# Altium project iMX8M_CPU.PrjPcb (part 2 of 2)

## Sheet P[12]SOM_Interface.SchDoc
size A3
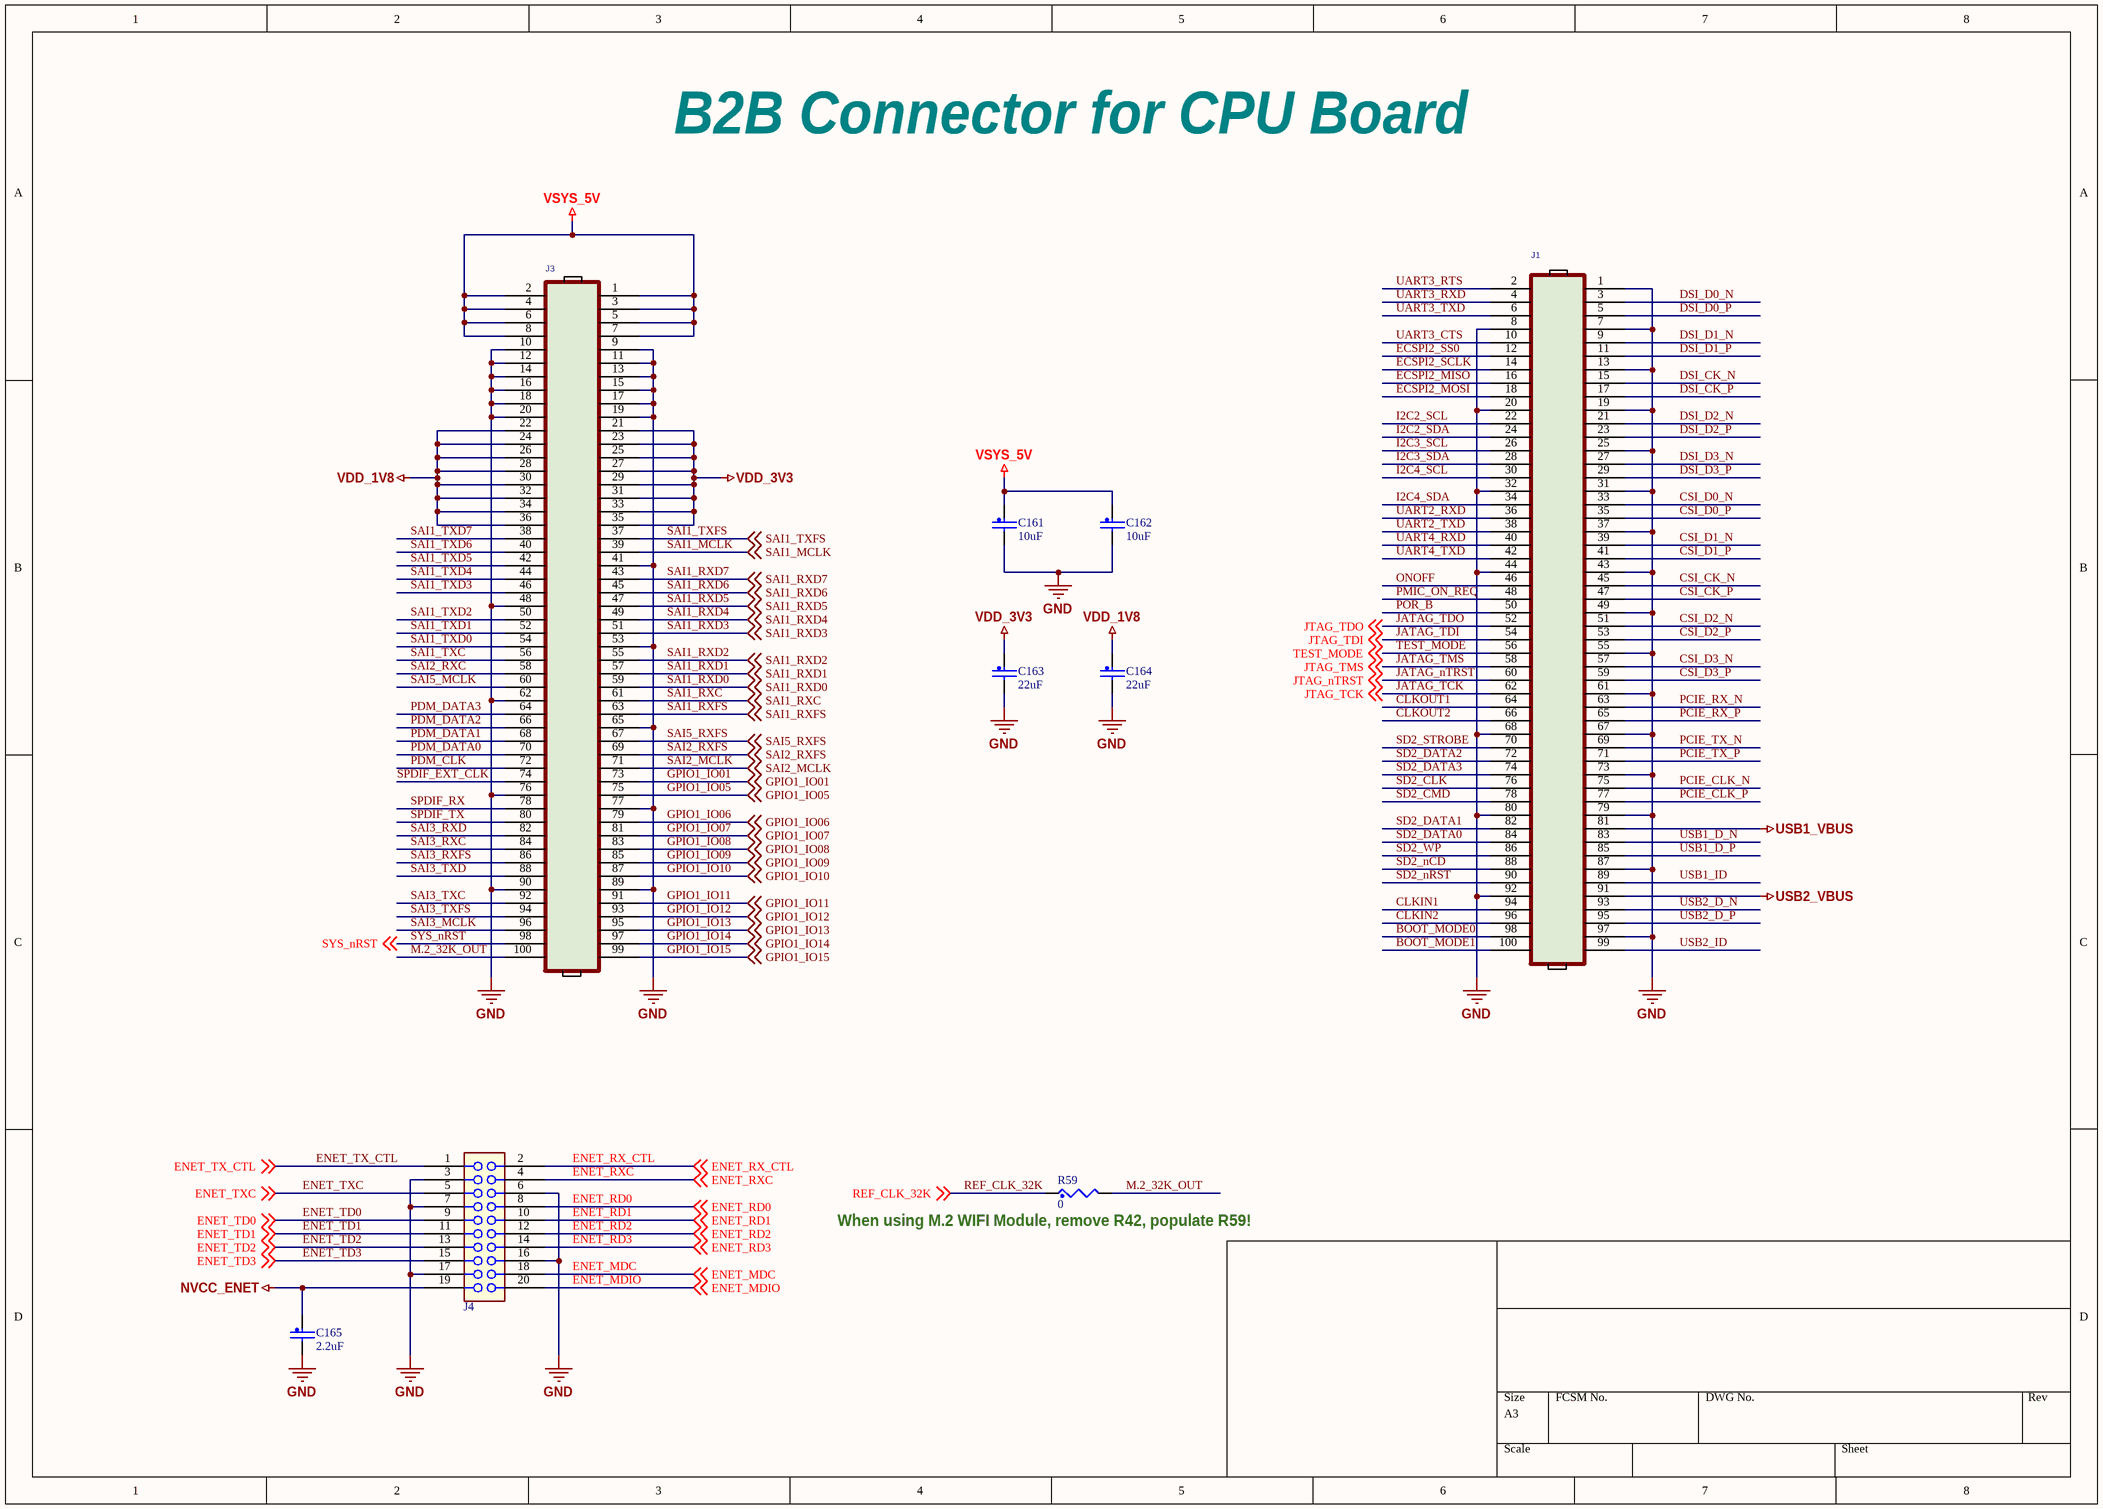
[diagram p9: P[12]SOM_Interface.SchDoc]

### Parts
C161  10uF  [0603_CC]
C162  10uF  [0603_CC]
C163  22uF  [0603_CC]
C164  22uF  [0603_CC]
C165  2.2uF  [0402_CC - C]
J1  CON 2X50 PLUG SHRD SMT 0.4MM SP 51H AU  [CON100_0P4_21P7X2P05_SM]  (value not drawn)
J3  CON 2X50 PLUG SHRD SMT 0.4MM SP 51H AU  [CON100_0P4_22P8X3P1_SM]  (value not drawn)
J4  CONN_HDR_10X2_CON20_0P4_6P8X3P1  [CON20_0P4_6P8X3P1_SM]  (value not drawn)
R59  0  [0402_CC]

### Nets
GND: C161.2 C162.2 C163.2 C164.2 C165.2 J1.1 J1.7 J1.8 J1.13 J1.19 J1.20 J1.25 J1.31 J1.32 J1.37 J1.43 J1.44 J1.49 J1.55 J1.61 J1.67 J1.68 J1.73 J1.79 J1.80 J1.87 J1.92 J1.97 J3.9 J3.10 J3.11 J3.12 J3.13 J3.14 J3.15 J3.16 J3.17 J3.18 J3.19 J3.20 J3.41 J3.48 J3.53 J3.62 J3.65 J3.76 J3.77 J3.89 J3.90 J4.3 J4.6 J4.7 J4.16 J4.17
NVCC_ENET: C165.1 J4.19
USB1_VBUS: J1.81
USB2_VBUS: J1.91
VDD_1V8: C164.1 J3.22 J3.24 J3.26 J3.28 J3.30 J3.32 J3.34 J3.36
VDD_3V3: C163.1 J3.21 J3.23 J3.25 J3.27 J3.29 J3.31 J3.33 J3.35
VSYS_5V: C161.1 C162.1 J3.1 J3.2 J3.3 J3.4 J3.5 J3.6 J3.7 J3.8
BOOT_MODE0: J1.98
BOOT_MODE1: J1.100
CLKIN1: J1.94
CLKIN2: J1.96
CLKOUT1: J1.64
CLKOUT2: J1.66
CSI_CK_N: J1.45
CSI_CK_P: J1.47
CSI_D0_N: J1.33
CSI_D0_P: J1.35
CSI_D1_N: J1.39
CSI_D1_P: J1.41
CSI_D2_N: J1.51
CSI_D2_P: J1.53
CSI_D3_N: J1.57
CSI_D3_P: J1.59
DSI_CK_N: J1.15
DSI_CK_P: J1.17
DSI_D0_N: J1.3
DSI_D0_P: J1.5
DSI_D1_N: J1.9
DSI_D1_P: J1.11
DSI_D2_N: J1.21
DSI_D2_P: J1.23
DSI_D3_N: J1.27
DSI_D3_P: J1.29
ECSPI2_MISO: J1.16
ECSPI2_MOSI: J1.18
ECSPI2_SCLK: J1.14
ECSPI2_SS0: J1.12
ENET_MDC: J4.18 ; off-sheet ENET_MDC
ENET_MDIO: J4.20 ; off-sheet ENET_MDIO
ENET_RD0: J4.8 ; off-sheet ENET_RD0
ENET_RD1: J4.10 ; off-sheet ENET_RD1
ENET_RD2: J4.12 ; off-sheet ENET_RD2
ENET_RD3: J4.14 ; off-sheet ENET_RD3
ENET_RX_CTL: J4.2 ; off-sheet ENET_RX_CTL
ENET_RXC: J4.4 ; off-sheet ENET_RXC
ENET_TD0: J4.9 ; off-sheet ENET_TD0
ENET_TD1: J4.11 ; off-sheet ENET_TD1
ENET_TD2: J4.13 ; off-sheet ENET_TD2
ENET_TD3: J4.15 ; off-sheet ENET_TD3
ENET_TX_CTL: J4.1 ; off-sheet ENET_TX_CTL
ENET_TXC: J4.5 ; off-sheet ENET_TXC
GPIO1_IO01: J3.73 ; off-sheet GPIO1_IO01
GPIO1_IO05: J3.75 ; off-sheet GPIO1_IO05
GPIO1_IO06: J3.79 ; off-sheet GPIO1_IO06
GPIO1_IO07: J3.81 ; off-sheet GPIO1_IO07
GPIO1_IO08: J3.83 ; off-sheet GPIO1_IO08
GPIO1_IO09: J3.85 ; off-sheet GPIO1_IO09
GPIO1_IO10: J3.87 ; off-sheet GPIO1_IO10
GPIO1_IO11: J3.91 ; off-sheet GPIO1_IO11
GPIO1_IO12: J3.93 ; off-sheet GPIO1_IO12
GPIO1_IO13: J3.95 ; off-sheet GPIO1_IO13
GPIO1_IO14: J3.97 ; off-sheet GPIO1_IO14
GPIO1_IO15: J3.99 ; off-sheet GPIO1_IO15
I2C2_SCL: J1.22
I2C2_SDA: J1.24
I2C3_SCL: J1.26
I2C3_SDA: J1.28
I2C4_SCL: J1.30
I2C4_SDA: J1.34
JATAG_nTRST: J1.60 ; off-sheet JTAG_nTRST  [also labelled JTAG_nTRST]
JATAG_TCK: J1.62 ; off-sheet JTAG_TCK  [also labelled JTAG_TCK]
JATAG_TDI: J1.54 ; off-sheet JTAG_TDI  [also labelled JTAG_TDI]
JATAG_TDO: J1.52 ; off-sheet JTAG_TDO  [also labelled JTAG_TDO]
JATAG_TMS: J1.58 ; off-sheet JTAG_TMS  [also labelled JTAG_TMS]
M.2_32K_OUT: J3.100 R59.2
ONOFF: J1.46
PCIE_CLK_N: J1.75
PCIE_CLK_P: J1.77
PCIE_RX_N: J1.63
PCIE_RX_P: J1.65
PCIE_TX_N: J1.69
PCIE_TX_P: J1.71
PDM_CLK: J3.72
PDM_DATA0: J3.70
PDM_DATA1: J3.68
PDM_DATA2: J3.66
PDM_DATA3: J3.64
PMIC_ON_REQ: J1.48
POR_B: J1.50
REF_CLK_32K: R59.1 ; off-sheet REF_CLK_32K
SAI1_MCLK: J3.39 ; off-sheet SAI1_MCLK
SAI1_RXC: J3.61 ; off-sheet SAI1_RXC
SAI1_RXD0: J3.59 ; off-sheet SAI1_RXD0
SAI1_RXD1: J3.57 ; off-sheet SAI1_RXD1
SAI1_RXD2: J3.55 ; off-sheet SAI1_RXD2
SAI1_RXD3: J3.51 ; off-sheet SAI1_RXD3
SAI1_RXD4: J3.49 ; off-sheet SAI1_RXD4
SAI1_RXD5: J3.47 ; off-sheet SAI1_RXD5
SAI1_RXD6: J3.45 ; off-sheet SAI1_RXD6
SAI1_RXD7: J3.43 ; off-sheet SAI1_RXD7
SAI1_RXFS: J3.63 ; off-sheet SAI1_RXFS
SAI1_TXC: J3.56
SAI1_TXD0: J3.54
SAI1_TXD1: J3.52
SAI1_TXD2: J3.50
SAI1_TXD3: J3.46
SAI1_TXD4: J3.44
SAI1_TXD5: J3.42
SAI1_TXD6: J3.40
SAI1_TXD7: J3.38
SAI1_TXFS: J3.37 ; off-sheet SAI1_TXFS
SAI2_MCLK: J3.71 ; off-sheet SAI2_MCLK
SAI2_RXC: J3.58
SAI2_RXFS: J3.69 ; off-sheet SAI2_RXFS
SAI3_MCLK: J3.96
SAI3_RXC: J3.84
SAI3_RXD: J3.82
SAI3_RXFS: J3.86
SAI3_TXC: J3.92
SAI3_TXD: J3.88
SAI3_TXFS: J3.94
SAI5_MCLK: J3.60
SAI5_RXFS: J3.67 ; off-sheet SAI5_RXFS
SD2_CLK: J1.76
SD2_CMD: J1.78
SD2_DATA0: J1.84
SD2_DATA1: J1.82
SD2_DATA2: J1.72
SD2_DATA3: J1.74
SD2_nCD: J1.88
SD2_nRST: J1.90
SD2_STROBE: J1.70
SD2_WP: J1.86
SPDIF_EXT_CLK: J3.74
SPDIF_RX: J3.78
SPDIF_TX: J3.80
SYS_nRST: J3.98 ; off-sheet SYS_nRST
TEST_MODE: J1.56 ; off-sheet TEST_MODE
UART2_RXD: J1.36
UART2_TXD: J1.38
UART3_CTS: J1.10
UART3_RTS: J1.2
UART3_RXD: J1.4
UART3_TXD: J1.6
UART4_RXD: J1.40
UART4_TXD: J1.42
USB1_D_N: J1.83
USB1_D_P: J1.85
USB1_ID: J1.89
USB2_D_N: J1.93
USB2_D_P: J1.95
USB2_ID: J1.99

### Notes on the sheet
- B2B Connector for CPU Board
- (near R59) When using M.2 WIFI Module, remove R42, populate R59!

### Library data of the parts
C161-C165 = CAP_NP: CLASS: DISCRETE
J1 J3 = HDR_2X50_M: CLASS: IO; CAD_APPROVED: Yes; Temp_Range: -35 to 85 &#8451;; MFG_PN01: DF40C-100DP-0.4V(51); MFG_NAME01: Hirose; AGILE_PN: 211-80305; HEIGHT: 1.29MM; ROHS: Yes
J4 = CONN_HDR_10X2: CONN_HDR_10X2_CON20_0P4_6P8X3P1\By Arman Arvand; CLASS: IO
R59 = RES: CLASS: DISCRETE

## Sheet P[13]BOOT_CFG.SchDoc
size 513 x 386 mm
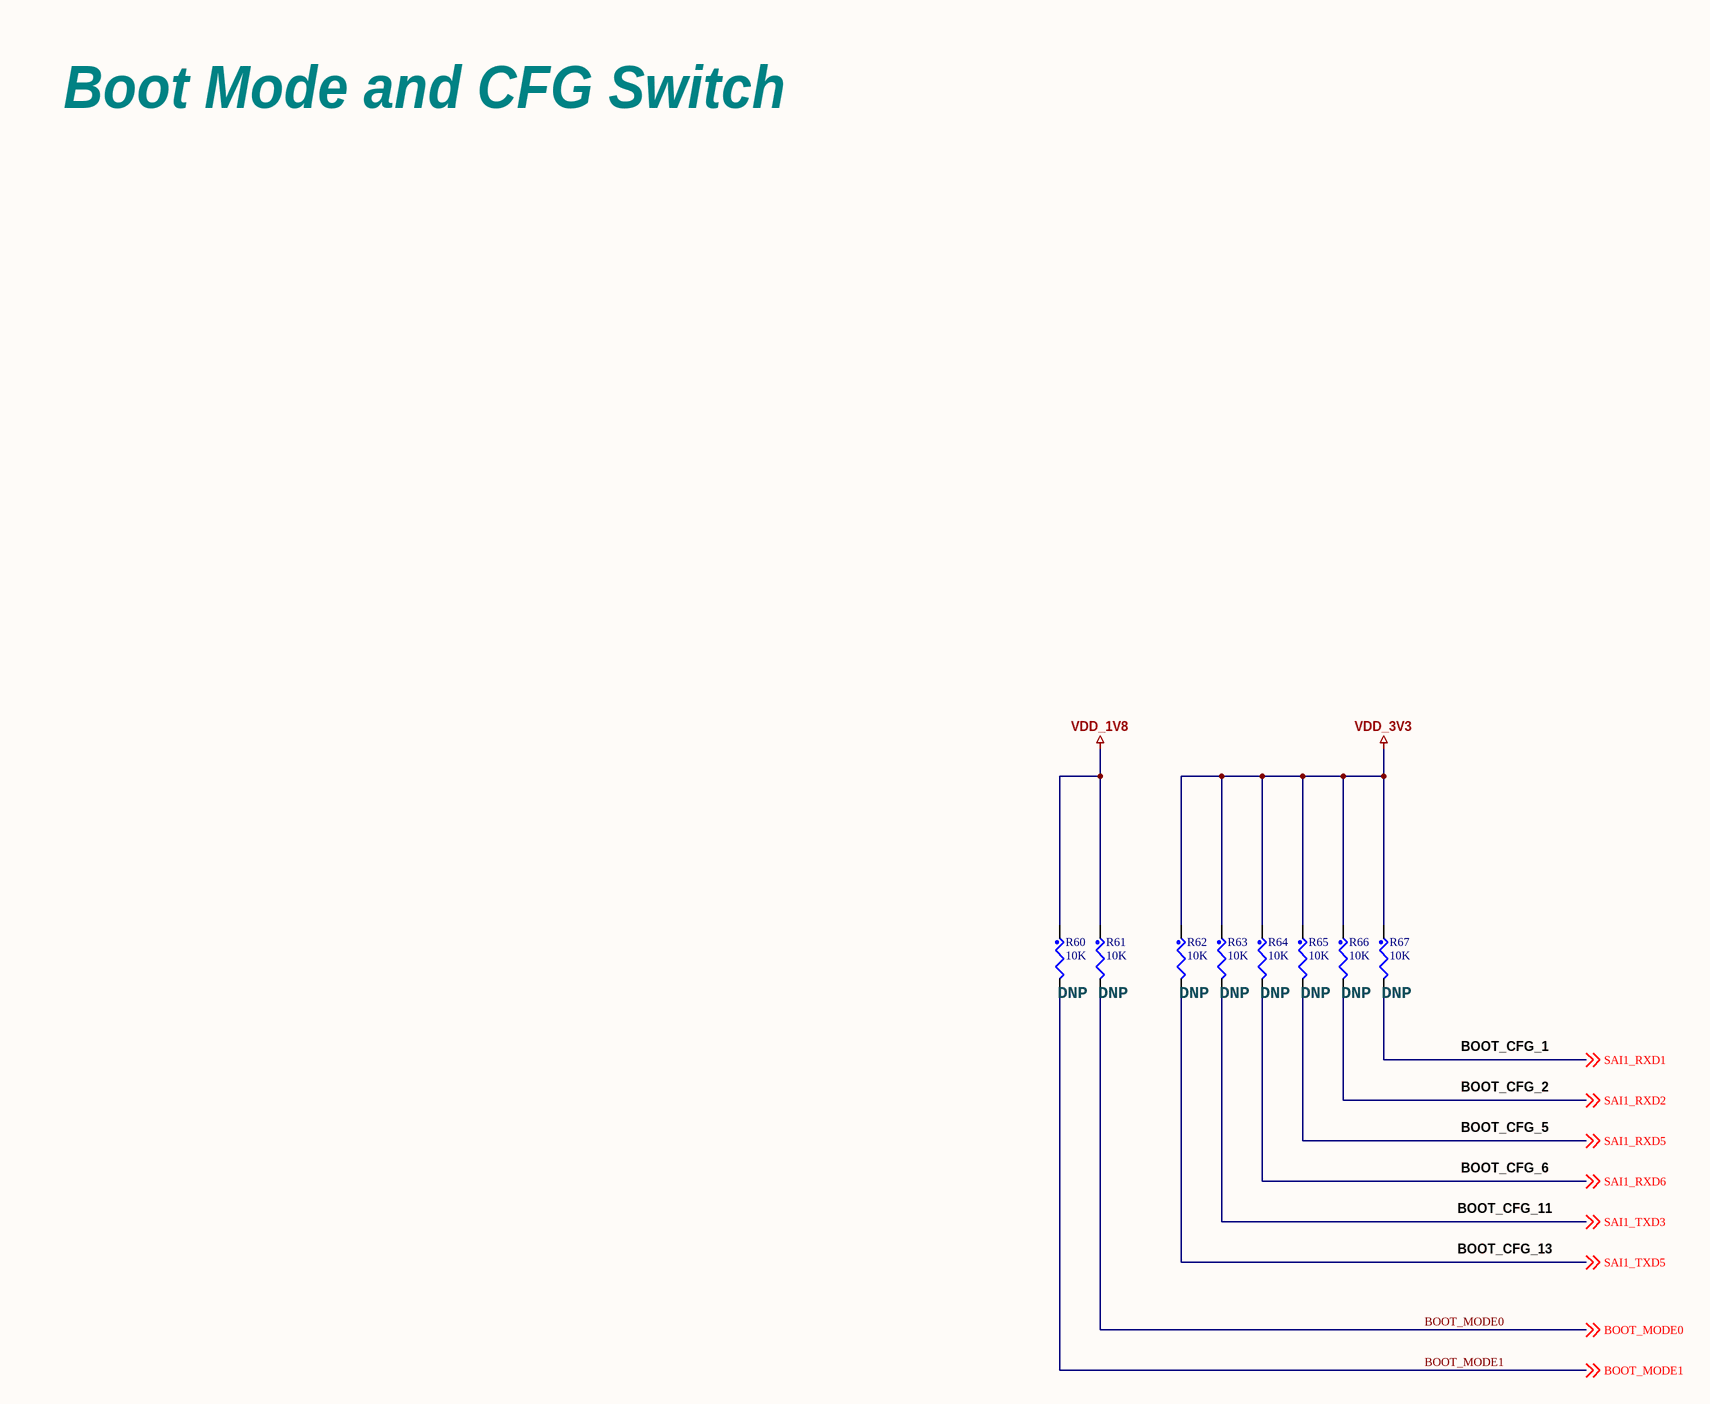
[diagram p10: P[13]BOOT_CFG.SchDoc]

### Parts
R60  10K  [0402_CC]
R61  10K  [0402_CC]
R62  10K  [0402_CC]
R63  10K  [0402_CC]
R64  10K  [0402_CC]
R65  10K  [0402_CC]
R66  10K  [0402_CC]
R67  10K  [0402_CC]

### Nets
VDD_1V8: R60.1 R61.1
VDD_3V3: R62.1 R63.1 R64.1 R65.1 R66.1 R67.1
BOOT_MODE0: R61.2 ; off-sheet BOOT_MODE0
BOOT_MODE1: R60.2 ; off-sheet BOOT_MODE1
SAI1_RXD1: R67.2 ; off-sheet SAI1_RXD1
SAI1_RXD2: R66.2 ; off-sheet SAI1_RXD2
SAI1_RXD5: R65.2 ; off-sheet SAI1_RXD5
SAI1_RXD6: R64.2 ; off-sheet SAI1_RXD6
SAI1_TXD3: R63.2 ; off-sheet SAI1_TXD3
SAI1_TXD5: R62.2 ; off-sheet SAI1_TXD5

### Notes on the sheet
- Boot Mode and CFG Switch
- (near R60) DNP
- (near R61) DNP
- (near R62) DNP
- (near R63) DNP
- (near R64) DNP
- (near R65) DNP
- (near R66) DNP
- (near R67) DNP
- BOOT_CFG_1
- BOOT_CFG_2
- BOOT_CFG_5
- BOOT_CFG_6
- BOOT_CFG_11
- BOOT_CFG_13

### Library data of the parts
R60-R67 = RES: CLASS: DISCRETE

## Nets that join several sheets
GND: P[04]_CPU_POWER (159 pins), P[05]_PMIC (42 pins), P[06]_LPDDR4 (107 pins), P[07]_CPU_PHY (5 pins), P[08]_CPU_MISC (8 pins), P[09]_eMMC_QSPI (24 pins), P[10]WIFI_Bluetooth (37 pins), P[11]_CPU_IO (C143.2 Q1.2), P[12]SOM_Interface (54 pins)
NVCC_DRAM_1V1: P[04]_CPU_POWER (21 pins), P[05]_PMIC (C87.2 C88.2 L6.2 U3.38), P[06]_LPDDR4 (83 pins)
NVCC_ENET: P[04]_CPU_POWER (C20.1 U1.W22), P[12]SOM_Interface (C165.1 J4.19)
NVCC_SD2: P[04]_CPU_POWER (C19.1 U1.V22), P[05]_PMIC (C82.2 U3.55), P[11]_CPU_IO (R56.1 R57.1 R58.1)
NVCC_SNVS_1V8: P[04]_CPU_POWER (C5.1 U1.J22), P[05]_PMIC (5 pins), P[08]_CPU_MISC (R28.1 R29.1 R30.1)
USB1_VBUS: P[07]_CPU_PHY (C119.1 R23.2), P[12]SOM_Interface (J1.81)
USB2_VBUS: P[07]_CPU_PHY (C120.1 R26.2), P[12]SOM_Interface (J1.91)
VDD_1V8: P[04]_CPU_POWER (17 pins), P[05]_PMIC (9 pins), P[06]_LPDDR4 (16 pins), P[09]_eMMC_QSPI (15 pins), P[10]WIFI_Bluetooth (10 pins), P[11]_CPU_IO (8 pins), P[12]SOM_Interface (9 pins), P[13]BOOT_CFG (R60.1 R61.1)
VDD_3V3: P[04]_CPU_POWER (10 pins), P[05]_PMIC (7 pins), P[09]_eMMC_QSPI (7 pins), P[10]WIFI_Bluetooth (C136.1 C137.1 U6.41), P[11]_CPU_IO (R47.1), P[12]SOM_Interface (9 pins), P[13]BOOT_CFG (6 pins)
VDD_ARM_0V9: P[04]_CPU_POWER (20 pins), P[05]_PMIC (C62.2 C63.2 L2.2 U3.24)
VDD_DRAM_PU_0V9: P[04]_CPU_POWER (27 pins), P[05]_PMIC (C73.2 C74.2 L3.2 U3.30)
VDD_PHY_0V9: P[04]_CPU_POWER (C53.1 U1.J14), P[05]_PMIC (C69.1 U3.42)
VDD_PHY_1V2: P[04]_CPU_POWER (R1.2), P[05]_PMIC (C72.1 U3.44)
VDD_SNVS_0V8: P[04]_CPU_POWER (C6.1 U1.K22), P[05]_PMIC (C65.1 U3.8), P[08]_CPU_MISC (R34.1)
VDD_SOC_0V8: P[04]_CPU_POWER (25 pins), P[05]_PMIC (C59.2 C60.2 L1.2 U3.17)
VDDA_1V8: P[04]_CPU_POWER (17 pins), P[05]_PMIC (C76.1 U3.6)
VSYS_5V: P[05]_PMIC (22 pins), P[12]SOM_Interface (10 pins)
BOOT_MODE0: P[08]_CPU_MISC (U1.G26), P[12]SOM_Interface (J1.98), P[13]BOOT_CFG (R61.2)
BOOT_MODE1: P[08]_CPU_MISC (U1.G27), P[12]SOM_Interface (J1.100), P[13]BOOT_CFG (R60.2)
BT_CTS: P[10]WIFI_Bluetooth (U6.30), P[11]_CPU_IO (U1.E18)
BT_REG_ON: P[10]WIFI_Bluetooth (U6.40), P[11]_CPU_IO (U1.U27)
BT_RTS: P[10]WIFI_Bluetooth (U6.29), P[11]_CPU_IO (U1.D18)
BT_RXD: P[10]WIFI_Bluetooth (U6.27), P[11]_CPU_IO (U1.F13)
BT_TXD: P[10]WIFI_Bluetooth (U6.28), P[11]_CPU_IO (U1.E14)
BT_WAKE_DEV: P[10]WIFI_Bluetooth (U6.26), P[11]_CPU_IO (U1.U26)
BT_WAKE_HOST: P[10]WIFI_Bluetooth (U6.17), P[11]_CPU_IO (U1.W27)
CLK_32K_OUT: P[05]_PMIC (U3.29), P[08]_CPU_MISC (R33.1)
CLKIN1: P[08]_CPU_MISC (U1.H27), P[12]SOM_Interface (J1.94)
CLKIN2: P[08]_CPU_MISC (U1.J27), P[12]SOM_Interface (J1.96)
CLKOUT1: P[08]_CPU_MISC (U1.H26), P[12]SOM_Interface (J1.64)
CLKOUT2: P[08]_CPU_MISC (U1.J26), P[12]SOM_Interface (J1.66)
CSI_CK_N: P[07]_CPU_PHY (U1.A16), P[12]SOM_Interface (J1.45)
CSI_CK_P: P[07]_CPU_PHY (U1.B16), P[12]SOM_Interface (J1.47)
CSI_D0_N: P[07]_CPU_PHY (U1.A14), P[12]SOM_Interface (J1.33)
CSI_D0_P: P[07]_CPU_PHY (U1.B14), P[12]SOM_Interface (J1.35)
CSI_D1_N: P[07]_CPU_PHY (U1.A15), P[12]SOM_Interface (J1.39)
CSI_D1_P: P[07]_CPU_PHY (U1.B15), P[12]SOM_Interface (J1.41)
CSI_D2_N: P[07]_CPU_PHY (U1.A17), P[12]SOM_Interface (J1.51)
CSI_D2_P: P[07]_CPU_PHY (U1.B17), P[12]SOM_Interface (J1.53)
CSI_D3_N: P[07]_CPU_PHY (U1.A18), P[12]SOM_Interface (J1.57)
CSI_D3_P: P[07]_CPU_PHY (U1.B18), P[12]SOM_Interface (J1.59)
DSI_CK_N: P[07]_CPU_PHY (U1.A11), P[12]SOM_Interface (J1.15)
DSI_CK_P: P[07]_CPU_PHY (U1.B11), P[12]SOM_Interface (J1.17)
DSI_D0_N: P[07]_CPU_PHY (U1.A9), P[12]SOM_Interface (J1.3)
DSI_D0_P: P[07]_CPU_PHY (U1.B9), P[12]SOM_Interface (J1.5)
DSI_D1_N: P[07]_CPU_PHY (U1.A10), P[12]SOM_Interface (J1.9)
DSI_D1_P: P[07]_CPU_PHY (U1.B10), P[12]SOM_Interface (J1.11)
DSI_D2_N: P[07]_CPU_PHY (U1.A12), P[12]SOM_Interface (J1.21)
DSI_D2_P: P[07]_CPU_PHY (U1.B12), P[12]SOM_Interface (J1.23)
DSI_D3_N: P[07]_CPU_PHY (U1.A13), P[12]SOM_Interface (J1.27)
DSI_D3_P: P[07]_CPU_PHY (U1.B13), P[12]SOM_Interface (J1.29)
ECSPI2_MISO: P[11]_CPU_IO (U1.A8), P[12]SOM_Interface (J1.16)
ECSPI2_MOSI: P[11]_CPU_IO (U1.B8), P[12]SOM_Interface (J1.18)
ECSPI2_SCLK: P[11]_CPU_IO (U1.E6), P[12]SOM_Interface (J1.14)
ECSPI2_SS0: P[11]_CPU_IO (U1.A6), P[12]SOM_Interface (J1.12)
ENET_MDC: P[11]_CPU_IO (U1.AC27), P[12]SOM_Interface (J4.18)
ENET_MDIO: P[11]_CPU_IO (U1.AB27), P[12]SOM_Interface (J4.20)
ENET_RD0: P[11]_CPU_IO (U1.AE27), P[12]SOM_Interface (J4.8)
ENET_RD1: P[11]_CPU_IO (U1.AD27), P[12]SOM_Interface (J4.10)
ENET_RD2: P[11]_CPU_IO (U1.AD26), P[12]SOM_Interface (J4.12)
ENET_RD3: P[11]_CPU_IO (U1.AC26), P[12]SOM_Interface (J4.14)
ENET_RX_CTL: P[11]_CPU_IO (U1.AF27), P[12]SOM_Interface (J4.2)
ENET_RXC: P[11]_CPU_IO (U1.AE26), P[12]SOM_Interface (J4.4)
ENET_TD0: P[11]_CPU_IO (U1.AG26), P[12]SOM_Interface (J4.9)
ENET_TD1: P[11]_CPU_IO (U1.AF26), P[12]SOM_Interface (J4.11)
ENET_TD2: P[11]_CPU_IO (U1.AG25), P[12]SOM_Interface (J4.13)
ENET_TD3: P[11]_CPU_IO (U1.AF25), P[12]SOM_Interface (J4.15)
ENET_TX_CTL: P[11]_CPU_IO (U1.AF24), P[12]SOM_Interface (J4.1)
ENET_TXC: P[11]_CPU_IO (U1.AG24), P[12]SOM_Interface (J4.5)
GPIO1_IO01: P[11]_CPU_IO (U1.AF14), P[12]SOM_Interface (J3.73)
GPIO1_IO05: P[11]_CPU_IO (U1.AF12), P[12]SOM_Interface (J3.75)
GPIO1_IO06: P[11]_CPU_IO (U1.AG11), P[12]SOM_Interface (J3.79)
GPIO1_IO07: P[11]_CPU_IO (U1.AF11), P[12]SOM_Interface (J3.81)
GPIO1_IO08: P[11]_CPU_IO (U1.AG10), P[12]SOM_Interface (J3.83)
GPIO1_IO09: P[11]_CPU_IO (U1.AF10), P[12]SOM_Interface (J3.85)
GPIO1_IO10: P[11]_CPU_IO (U1.AD10), P[12]SOM_Interface (J3.87)
GPIO1_IO11: P[11]_CPU_IO (U1.AC10), P[12]SOM_Interface (J3.91)
GPIO1_IO12: P[11]_CPU_IO (U1.AB10), P[12]SOM_Interface (J3.93)
GPIO1_IO13: P[11]_CPU_IO (U1.AD9), P[12]SOM_Interface (J3.95)
GPIO1_IO14: P[11]_CPU_IO (U1.AC9), P[12]SOM_Interface (J3.97)
GPIO1_IO15: P[11]_CPU_IO (U1.AB9), P[12]SOM_Interface (J3.99)
I2C1_SCL: P[05]_PMIC (R2.1), P[11]_CPU_IO (R48.2 U1.E9)
I2C1_SDA: P[05]_PMIC (R3.1), P[11]_CPU_IO (R49.2 U1.F9)
I2C2_SCL: P[11]_CPU_IO (R50.2 U1.D10), P[12]SOM_Interface (J1.22)
I2C2_SDA: P[11]_CPU_IO (R51.2 U1.D9), P[12]SOM_Interface (J1.24)
I2C3_SCL: P[11]_CPU_IO (R52.2 U1.E10), P[12]SOM_Interface (J1.26)
I2C3_SDA: P[11]_CPU_IO (R53.2 U1.F10), P[12]SOM_Interface (J1.28)
I2C4_SCL: P[11]_CPU_IO (R54.2 U1.D13), P[12]SOM_Interface (J1.30)
I2C4_SDA: P[11]_CPU_IO (R55.2 U1.E13), P[12]SOM_Interface (J1.34)
JATAG_nTRST: P[08]_CPU_MISC (U1.C27), P[12]SOM_Interface (J1.60)
JATAG_TCK: P[08]_CPU_MISC (R37.1 U1.F26), P[12]SOM_Interface (J1.62)
JATAG_TDI: P[08]_CPU_MISC (U1.E27), P[12]SOM_Interface (J1.54)
JATAG_TDO: P[08]_CPU_MISC (U1.E26), P[12]SOM_Interface (J1.52)
JATAG_TMS: P[08]_CPU_MISC (U1.F27), P[12]SOM_Interface (J1.58)
ONOFF: P[08]_CPU_MISC (R30.2 U1.A25), P[12]SOM_Interface (J1.46)
PCIE_CLK_N: P[07]_CPU_PHY (U1.A21), P[12]SOM_Interface (J1.75)
PCIE_CLK_P: P[07]_CPU_PHY (U1.B21), P[12]SOM_Interface (J1.77)
PCIE_RX_N: P[07]_CPU_PHY (U1.A19), P[12]SOM_Interface (J1.63)
PCIE_RX_P: P[07]_CPU_PHY (U1.B19), P[12]SOM_Interface (J1.65)
PCIE_TX_N: P[07]_CPU_PHY (U1.A20), P[12]SOM_Interface (J1.69)
PCIE_TX_P: P[07]_CPU_PHY (U1.B20), P[12]SOM_Interface (J1.71)
PDM_CLK: P[11]_CPU_IO (U1.AC15), P[12]SOM_Interface (J3.72)
PDM_DATA0: P[11]_CPU_IO (U1.AD18), P[12]SOM_Interface (J3.70)
PDM_DATA1: P[11]_CPU_IO (U1.AC14), P[12]SOM_Interface (J3.68)
PDM_DATA2: P[11]_CPU_IO (U1.AD13), P[12]SOM_Interface (J3.66)
PDM_DATA3: P[11]_CPU_IO (U1.AC13), P[12]SOM_Interface (J3.64)
PMIC_nINT: P[05]_PMIC (U3.39), P[11]_CPU_IO (U1.AF13)
PMIC_ON_REQ: P[05]_PMIC (R6.1), P[08]_CPU_MISC (U1.A24), P[12]SOM_Interface (J1.48)
PMIC_STBY_REQ: P[05]_PMIC (R8.1), P[08]_CPU_MISC (U1.E24)
POR_B: P[05]_PMIC (R7.2), P[08]_CPU_MISC (R29.2 U1.B24), P[12]SOM_Interface (J1.50)
QSPIA_DATA0: P[09]_eMMC_QSPI (U5.5), P[11]_CPU_IO (U1.P23)
QSPIA_DATA1: P[09]_eMMC_QSPI (U5.2), P[11]_CPU_IO (U1.K24)
QSPIA_DATA2: P[09]_eMMC_QSPI (U5.3), P[11]_CPU_IO (U1.K23)
QSPIA_DATA3: P[09]_eMMC_QSPI (U5.7), P[11]_CPU_IO (U1.N23)
QSPIA_nSS0: P[09]_eMMC_QSPI (R40.2 U5.1), P[11]_CPU_IO (U1.N24)
QSPIA_SCLK: P[09]_eMMC_QSPI (U5.6), P[11]_CPU_IO (U1.N22)
REF_CLK_32K: P[10]WIFI_Bluetooth (R42.1), P[11]_CPU_IO (U1.AG14), P[12]SOM_Interface (R59.1)
RTC_RESET_B: P[05]_PMIC (R10.2), P[08]_CPU_MISC (R28.2 U1.F24)
SAI1_MCLK: P[11]_CPU_IO (U1.AB18), P[12]SOM_Interface (J3.39)
SAI1_RXC: P[11]_CPU_IO (U1.AF16), P[12]SOM_Interface (J3.61)
SAI1_RXD0: P[11]_CPU_IO (U1.AG15), P[12]SOM_Interface (J3.59)
SAI1_RXD1: P[11]_CPU_IO (U1.AF15), P[12]SOM_Interface (J3.57), P[13]BOOT_CFG (R67.2)
SAI1_RXD2: P[11]_CPU_IO (U1.AG17), P[12]SOM_Interface (J3.55), P[13]BOOT_CFG (R66.2)
SAI1_RXD3: P[11]_CPU_IO (U1.AF17), P[12]SOM_Interface (J3.51)
SAI1_RXD4: P[11]_CPU_IO (U1.AG18), P[12]SOM_Interface (J3.49)
SAI1_RXD5: P[11]_CPU_IO (U1.AF18), P[12]SOM_Interface (J3.47), P[13]BOOT_CFG (R65.2)
SAI1_RXD6: P[11]_CPU_IO (U1.AG19), P[12]SOM_Interface (J3.45), P[13]BOOT_CFG (R64.2)
SAI1_RXD7: P[11]_CPU_IO (U1.AF19), P[12]SOM_Interface (J3.43)
SAI1_RXFS: P[11]_CPU_IO (U1.AG16), P[12]SOM_Interface (J3.63)
SAI1_TXC: P[11]_CPU_IO (U1.AC18), P[12]SOM_Interface (J3.56)
SAI1_TXD0: P[11]_CPU_IO (U1.AG20), P[12]SOM_Interface (J3.54)
SAI1_TXD1: P[11]_CPU_IO (U1.AF20), P[12]SOM_Interface (J3.52)
SAI1_TXD2: P[11]_CPU_IO (U1.AG21), P[12]SOM_Interface (J3.50)
SAI1_TXD3: P[11]_CPU_IO (U1.AF21), P[12]SOM_Interface (J3.46), P[13]BOOT_CFG (R63.2)
SAI1_TXD4: P[11]_CPU_IO (U1.AG22), P[12]SOM_Interface (J3.44)
SAI1_TXD5: P[11]_CPU_IO (U1.AF22), P[12]SOM_Interface (J3.42), P[13]BOOT_CFG (R62.2)
SAI1_TXD6: P[11]_CPU_IO (U1.AG23), P[12]SOM_Interface (J3.40)
SAI1_TXD7: P[11]_CPU_IO (U1.AF23), P[12]SOM_Interface (J3.38)
SAI1_TXFS: P[11]_CPU_IO (U1.AB19), P[12]SOM_Interface (J3.37)
SAI2_MCLK: P[11]_CPU_IO (U1.AD19), P[12]SOM_Interface (J3.71)
SAI2_RXC: P[11]_CPU_IO (U1.AB22), P[12]SOM_Interface (J3.58)
SAI2_RXD: P[10]WIFI_Bluetooth (R45.2), P[11]_CPU_IO (U1.AC24)
SAI2_RXFS: P[11]_CPU_IO (U1.AC19), P[12]SOM_Interface (J3.69)
SAI2_TXC: P[10]WIFI_Bluetooth (R41.2), P[11]_CPU_IO (U1.AD22)
SAI2_TXD: P[10]WIFI_Bluetooth (R44.2), P[11]_CPU_IO (U1.AC22)
SAI2_TXFS: P[10]WIFI_Bluetooth (R43.2), P[11]_CPU_IO (U1.AD23)
SAI3_MCLK: P[11]_CPU_IO (U1.AD6), P[12]SOM_Interface (J3.96)
SAI3_RXC: P[11]_CPU_IO (U1.AG7), P[12]SOM_Interface (J3.84)
SAI3_RXD: P[11]_CPU_IO (U1.AF7), P[12]SOM_Interface (J3.82)
SAI3_RXFS: P[11]_CPU_IO (U1.AG8), P[12]SOM_Interface (J3.86)
SAI3_TXC: P[11]_CPU_IO (U1.AG6), P[12]SOM_Interface (J3.92)
SAI3_TXD: P[11]_CPU_IO (U1.AF6), P[12]SOM_Interface (J3.88)
SAI3_TXFS: P[11]_CPU_IO (U1.AC6), P[12]SOM_Interface (J3.94)
SAI5_MCLK: P[11]_CPU_IO (U1.AD15), P[12]SOM_Interface (J3.60)
SAI5_RXFS: P[11]_CPU_IO (U1.AB15), P[12]SOM_Interface (J3.67)
SD1_CLK: P[10]WIFI_Bluetooth (U6.11), P[11]_CPU_IO (U1.V26)
SD1_CMD: P[10]WIFI_Bluetooth (U6.10), P[11]_CPU_IO (U1.V27)
SD1_DATA0: P[10]WIFI_Bluetooth (U6.9), P[11]_CPU_IO (U1.Y27)
SD1_DATA1: P[10]WIFI_Bluetooth (U6.8), P[11]_CPU_IO (U1.Y26)
SD1_DATA2: P[10]WIFI_Bluetooth (U6.7), P[11]_CPU_IO (U1.T27)
SD1_DATA3: P[10]WIFI_Bluetooth (U6.6), P[11]_CPU_IO (U1.T26)
SD2_CLK: P[11]_CPU_IO (U1.W23), P[12]SOM_Interface (J1.76)
SD2_CMD: P[11]_CPU_IO (R57.2 U1.W24), P[12]SOM_Interface (J1.78)
SD2_DATA0: P[11]_CPU_IO (R56.2 U1.AB23), P[12]SOM_Interface (J1.84)
SD2_DATA1: P[11]_CPU_IO (U1.AB24), P[12]SOM_Interface (J1.82)
SD2_DATA2: P[11]_CPU_IO (U1.V24), P[12]SOM_Interface (J1.72)
SD2_DATA3: P[11]_CPU_IO (U1.V23), P[12]SOM_Interface (J1.74)
SD2_nCD: P[11]_CPU_IO (U1.AA26), P[12]SOM_Interface (J1.88)
SD2_nRST: P[11]_CPU_IO (R58.2 U1.AB26), P[12]SOM_Interface (J1.90)
SD2_VSEL: P[05]_PMIC (U3.45), P[11]_CPU_IO (U1.AG12)
SD2_WP: P[11]_CPU_IO (U1.AA27), P[12]SOM_Interface (J1.86)
SD3_CLK: P[09]_eMMC_QSPI (U4.M6), P[11]_CPU_IO (U1.R26)
SD3_CMD: P[09]_eMMC_QSPI (R39.2 U4.M5), P[11]_CPU_IO (U1.R27)
SD3_DATA0: P[09]_eMMC_QSPI (R38.2 U4.A3), P[11]_CPU_IO (U1.M26)
SD3_DATA1: P[09]_eMMC_QSPI (U4.A4), P[11]_CPU_IO (U1.L26)
SD3_DATA2: P[09]_eMMC_QSPI (U4.A5), P[11]_CPU_IO (U1.K26)
SD3_DATA3: P[09]_eMMC_QSPI (U4.B2), P[11]_CPU_IO (U1.N26)
SD3_DATA4: P[09]_eMMC_QSPI (U4.B3), P[11]_CPU_IO (U1.N27)
SD3_DATA5: P[09]_eMMC_QSPI (U4.B4), P[11]_CPU_IO (U1.M27)
SD3_DATA6: P[09]_eMMC_QSPI (U4.B5), P[11]_CPU_IO (U1.L27)
SD3_DATA7: P[09]_eMMC_QSPI (U4.B6), P[11]_CPU_IO (U1.K27)
SD3_STROBE: P[09]_eMMC_QSPI (U4.H5), P[11]_CPU_IO (U1.P27)
SPDIF_EXT_CLK: P[11]_CPU_IO (U1.AF8), P[12]SOM_Interface (J3.74)
SPDIF_RX: P[11]_CPU_IO (U1.AG9), P[12]SOM_Interface (J3.78)
SPDIF_TX: P[11]_CPU_IO (U1.AF9), P[12]SOM_Interface (J3.80)
SYS_nRST: P[05]_PMIC (R11.1), P[12]SOM_Interface (J3.98)
TEST_MODE: P[08]_CPU_MISC (R31.2), P[12]SOM_Interface (J1.56)
UART2_RXD: P[11]_CPU_IO (U1.F15), P[12]SOM_Interface (J1.36)
UART2_TXD: P[11]_CPU_IO (U1.E15), P[12]SOM_Interface (J1.38)
UART3_CTS: P[11]_CPU_IO (U1.A7), P[12]SOM_Interface (J1.10)
UART3_RTS: P[11]_CPU_IO (U1.B6), P[12]SOM_Interface (J1.2)
UART3_RXD: P[11]_CPU_IO (U1.D6), P[12]SOM_Interface (J1.4)
UART3_TXD: P[11]_CPU_IO (U1.B7), P[12]SOM_Interface (J1.6)
UART4_RXD: P[11]_CPU_IO (U1.F19), P[12]SOM_Interface (J1.40)
UART4_TXD: P[11]_CPU_IO (U1.F18), P[12]SOM_Interface (J1.42)
USB1_D_N: P[07]_CPU_PHY (U1.A22), P[12]SOM_Interface (J1.83)
USB1_D_P: P[07]_CPU_PHY (U1.B22), P[12]SOM_Interface (J1.85)
USB1_ID: P[07]_CPU_PHY (U1.D22), P[12]SOM_Interface (J1.89)
USB2_D_N: P[07]_CPU_PHY (U1.A23), P[12]SOM_Interface (J1.93)
USB2_D_P: P[07]_CPU_PHY (U1.B23), P[12]SOM_Interface (J1.95)
USB2_ID: P[07]_CPU_PHY (U1.D23), P[12]SOM_Interface (J1.99)
WDOG_B: P[05]_PMIC (R5.1), P[11]_CPU_IO (U1.AG13)
WL_REG_ON: P[10]WIFI_Bluetooth (U6.39), P[11]_CPU_IO (U1.R23)
WL_WAKE_HOST: P[10]WIFI_Bluetooth (U6.13), P[11]_CPU_IO (U1.W26)